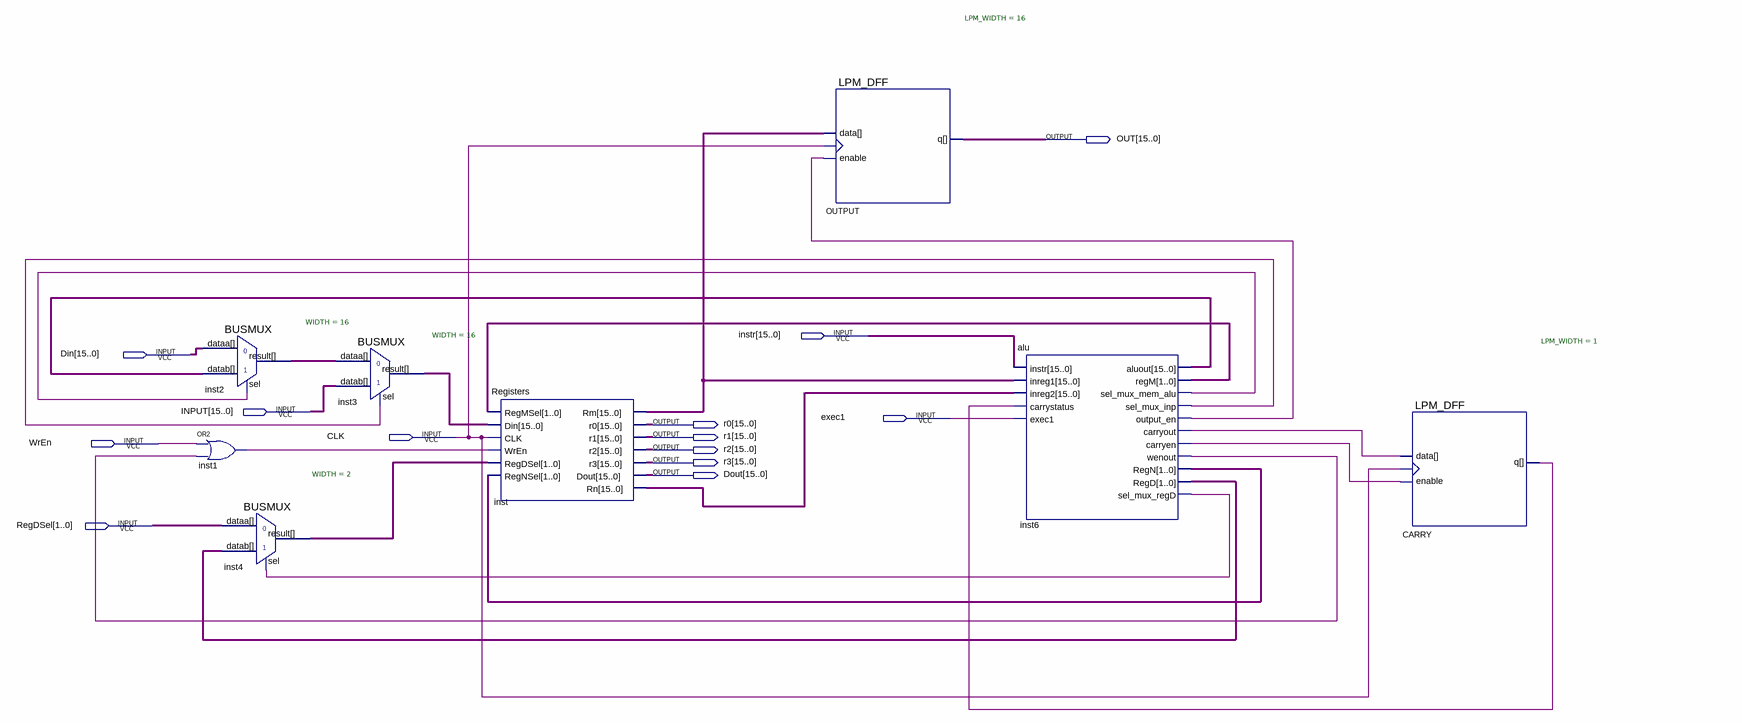
[diagram p0: schematic sheet]
// Quartus schematic top.bdf as structural Verilog: 8 symbols, 13 pins
module top (
  input  [15:0] instr,
  input  [15:0] Din,
  input  [15:0] INPUT,
  input  exec1,
  input  CLK,
  input  WrEn,
  input  [1:0] RegDSel,
  output [15:0] OUT,
  output [15:0] r0,
  output [15:0] r1,
  output [15:0] r2,
  output [15:0] r3,
  output [15:0] Dout
);

  wire CARRY_q, inst1_out, inst6_carryen, inst6_carryout, inst6_output_en, inst6_sel_mux_inp,
       inst6_sel_mux_mem_alu, inst6_sel_mux_regd, inst6_wenout;
  wire [1:0] inst4_result, inst6_regd, inst6_regm, inst6_regn;
  wire [15:0] inst2_result, inst3_result, inst6_aluout, inst_rm, inst_rn;

  BUSMUX #(.WIDTH(16)) inst2 (.datab(inst6_aluout), .sel(inst6_sel_mux_mem_alu), .dataa(Din), .result(inst2_result));
  or inst1 (inst1_out, WrEn, inst6_wenout);
  BUSMUX #(.WIDTH(2)) inst4 (.datab(inst6_regd), .sel(inst6_sel_mux_regd), .dataa(RegDSel), .result(inst4_result));
  BUSMUX #(.WIDTH(16)) inst3 (.datab(INPUT), .sel(inst6_sel_mux_inp), .dataa(inst2_result), .result(inst3_result));
  Registers inst (
    .RegMSel(inst6_regm), .Din(inst3_result), .CLK(CLK), .WrEn(inst1_out), .RegDSel(inst4_result),
    .RegNSel(inst6_regn), .Rm(inst_rm), .r0(r0), .r1(r1), .r2(r2), .r3(r3), .Dout(Dout), .Rn(inst_rn));
  LPM_DFF #(.LPM_WIDTH(16)) OUTPUT (.clock(CLK), .data(inst_rm), .enable(inst6_output_en), .q(OUT));
  alu inst6 (
    .instr(instr), .inreg1(inst_rm), .inreg2(inst_rn), .carrystatus(CARRY_q), .exec1(exec1),
    .aluout(inst6_aluout), .regM(inst6_regm), .sel_mux_mem_alu(inst6_sel_mux_mem_alu),
    .sel_mux_inp(inst6_sel_mux_inp), .output_en(inst6_output_en), .carryout(inst6_carryout),
    .carryen(inst6_carryen), .wenout(inst6_wenout), .RegN(inst6_regn), .RegD(inst6_regd),
    .sel_mux_regD(inst6_sel_mux_regd));
  LPM_DFF #(.LPM_WIDTH(1)) CARRY (.clock(CLK), .data(inst6_carryout), .enable(inst6_carryen), .q(CARRY_q));
endmodule
